# EAGLE design RedBot Accelerometer (EAGLE 9.6.0)
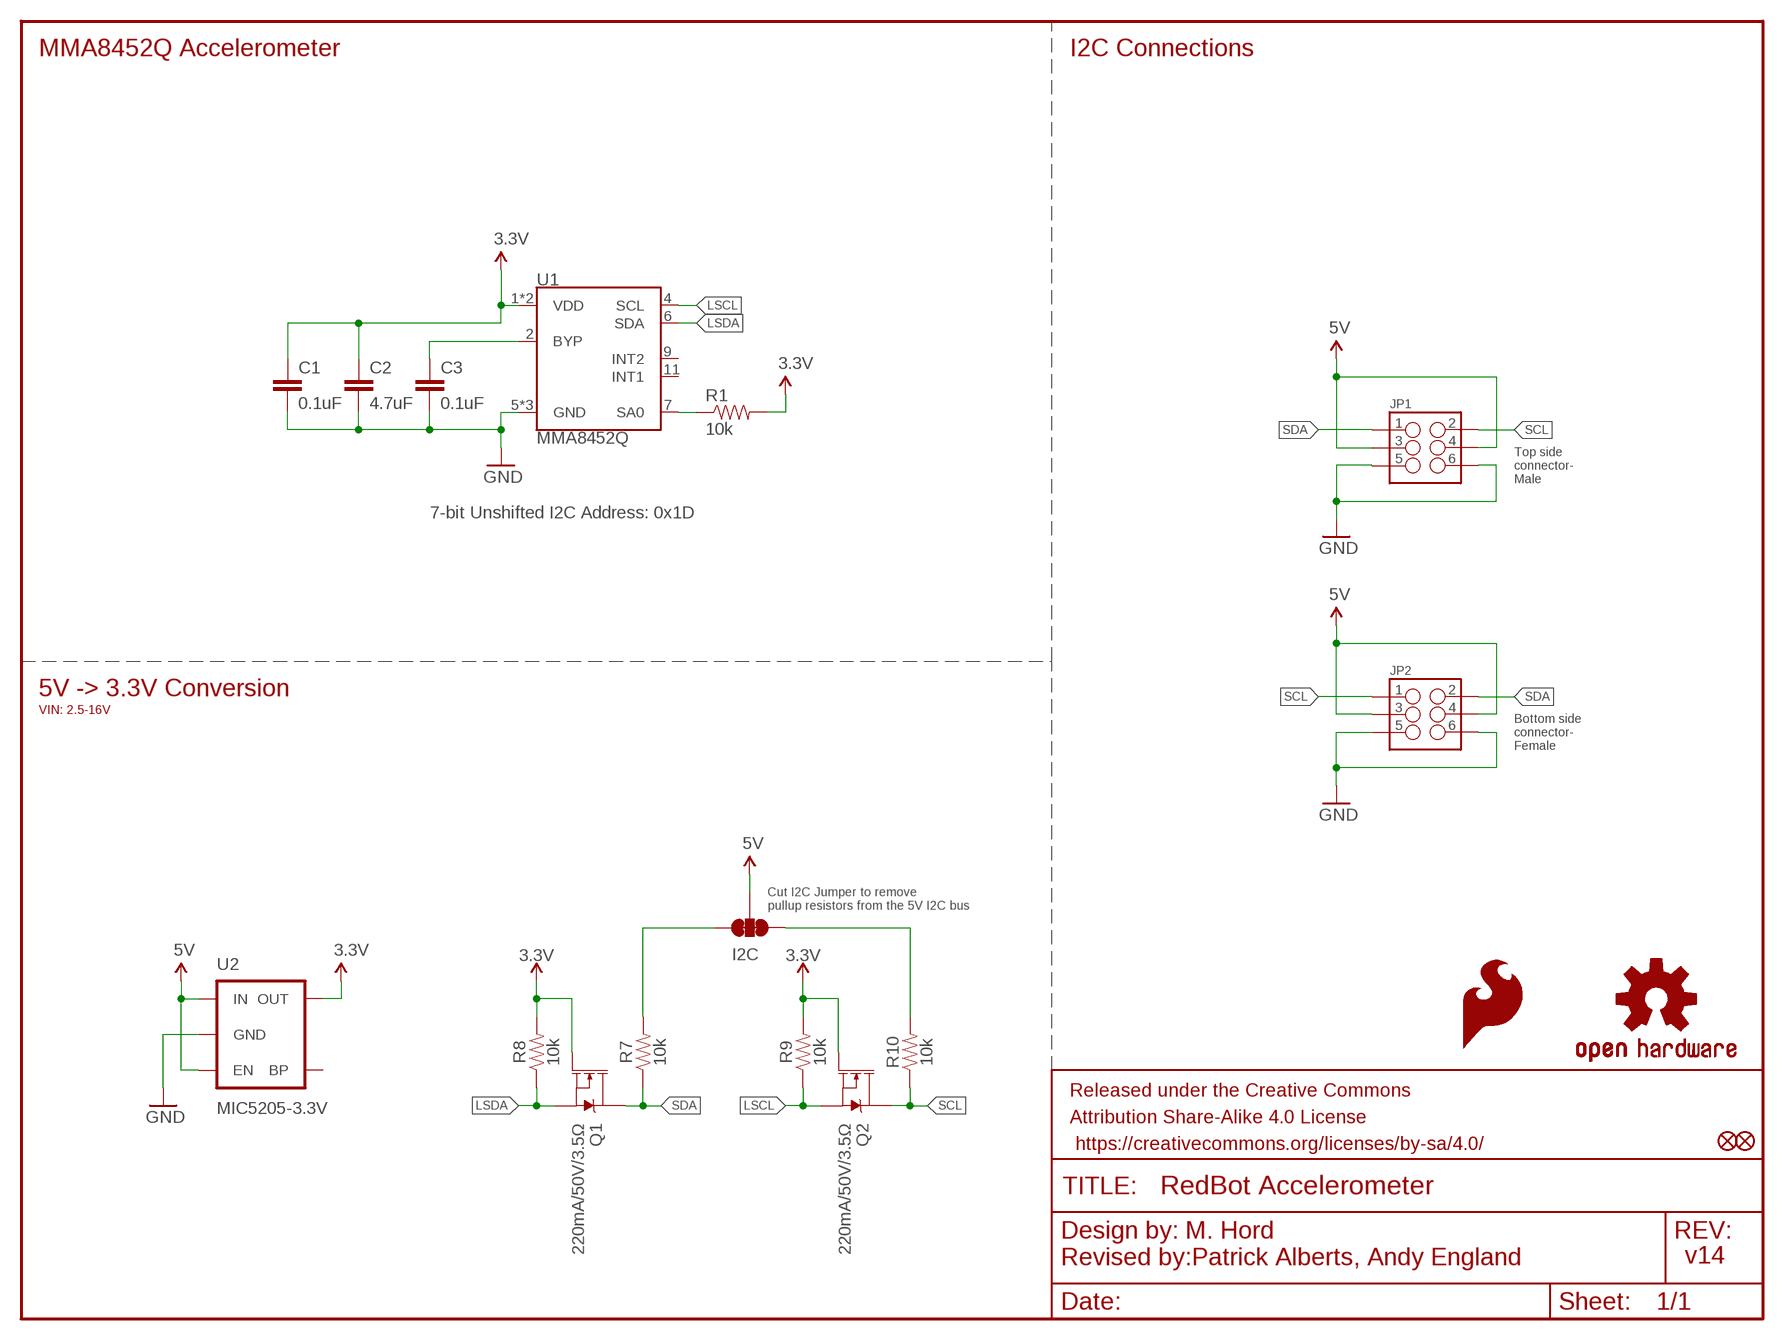
[diagram p0: schematic, sheet 1]

## Parts
C1  0.1uF  0.1UF-0603-25V-(+80/-20%)  [0603]
C2  4.7uF  4.7UF-0603-6.3V-(10%)  [0603]
C3  0.1uF  0.1UF-0603-25V-(+80/-20%)  [0603]
FID1  FIDUCIAL1X2  [FIDUCIAL-1X2]
FID3  FIDUCIAL1X2  [FIDUCIAL-1X2]
FRAME1  FRAME-LETTER  [CREATIVE_COMMONS]
I2C  JUMPER-SMT_3_2-NC_TRACE_SILK  [SMT-JUMPER_3_2-NC_TRACE_SILK]
JP1  M03X2SMT  [2X3_SMT_POSTS]
JP2  M03X2FEMALE_SMD  [2X3_SMD]
LOGO2  OSHW-LOGOS  [OSHW-LOGO-S]
LOGO4  SFE_LOGO_FLAME.1_INCH  [SFE_LOGO_FLAME_.1]
Q1  220mA/50V/3.5Ω  MOSFET-NCH-BSS138  [SOT23-3]
Q2  220mA/50V/3.5Ω  MOSFET-NCH-BSS138  [SOT23-3]
R1  10k  10KOHM-0603-1/10W-1%  [0603]
R7  10k  10KOHM-0603-1/10W-1%  [0603]
R8  10k  10KOHM-0603-1/10W-1%  [0603]
R9  10k  10KOHM-0603-1/10W-1%  [0603]
R10  10k  10KOHM-0603-1/10W-1%  [0603]
U1  MMA8452Q  [QFN-16]
U2  MIC5205-3.3V  MIC52053.3V  [SOT23-5]

## Nets
3.3V: C1.1 C2.1 Q1.1(G) Q2.1(G) R1.2 R8.2 R9.2 U1.1(VDD) U1.14(VDD) U2.5(OUT)
5V: I2C.2 JP1.3 JP1.4 JP2.3 JP2.4 U2.1(IN) U2.3(EN)
ADDR: R1.1 U1.7(SA0)
GND: C1.2 C2.2 C3.2 JP1.5 JP1.6 JP2.5 JP2.6 U1.5(GND) U1.10(GND) U1.12(GND) U2.2(GND)
LSCL: Q2.2(S) R9.1 U1.4(SCL)
LSDA: Q1.2(S) R8.1 U1.6(SDA)
N$1: C3.1 U1.2(BYP)
N$3: I2C.3 R7.2
N$4: I2C.1 R10.2
SCL: JP1.2 JP2.1 Q2.3(D) R10.1
SDA: JP1.1 JP2.2 Q1.3(D) R7.1
Unconnected: U1.9(INT2) U1.11(INT1) U2.4(BP)

## Notes on the sheet
- MMA8452Q Accelerometer | I2C Connections
- Top side
  connector-
  Male
- 7-bit Unshifted I2C Address: 0x1D
- 5V -> 3.3V Conversion
- VIN: 2.5-16V
- Bottom side
  connector-
  Female
- Cut I2C Jumper to remove 
  pullup resistors from the 5V I2C bus
- M. Hord
- Revised by:Patrick Alberts, Andy England | v14

## Library data of the parts
C1 C3 = SparkFun-Capacitors:0.1UF: 0.1µF ceramic capacitors A capacitor is a passive two-terminal electrical component used to store electrical energy temporarily in an electric field.; PROD_ID: CAP-00810
C2 = SparkFun-Capacitors:4.7UF: 4.7µF ceramic capacitors A capacitor is a passive two-terminal electrical component used to store electrical energy temporarily in an electric field.; PROD_ID: CAP-08280
FID1 FID3 = SparkFun-Aesthetics:FIDUCIAL: Fiducial Alignment Points Point-of-reference for pick-and-place machines and other optical instruments.
FRAME1 = SparkFun-Aesthetics:FRAME-LETTER: Schematic Frame - Letter Standard 8.5x11 US Letter frame
I2C = SparkFun-Jumpers:JUMPER-SMT_3_2-NC_TRACE: Normally closed trace jumper (2 of 2 connections) This jumper has a trace between all three pads so they are normally closed (NC). Use a razor knife to open the connection(s). For best results follow the IPC guidelines for cutting traces: Cutout at least 0.063 mm (0.005 in). Remove all loose material to clean up the cut area. Seal the cut with an approved epoxy. Reapply solder to reclose the connection(s).
JP1 = SparkFun-Connectors:M03X2: 2x3 .1" header. Shrouded, with keying- CONN-10681 SMT- CONN-11415 Pogo pins- HW-11044; PROD_ID: CONN-11415
JP2 = SparkFun-Connectors:M03X2: 2x3 .1" header. Shrouded, with keying- CONN-10681 SMT- CONN-11415 Pogo pins- HW-11044; PROD_ID: CONN-11290
LOGO2 = SparkFun-Aesthetics:OSHW-LOGO: Open-Source Hardware (OSHW) Logo This logo indicates the piece of hardware it is found on incorporates a OSHW license and/or adheres to the definition of open source hardware found here: http://freedomdefined.org/OSHW
LOGO4 = SparkFun-Aesthetics:SFE_LOGO_FLAME: SparkFun Flame Logo This is the SparkFun flame logo. The logo on the schematic will always be the same size; the package variant is the height of the flame. Default layer for the logo on the board is tSilk.
Q1 Q2 = SparkFun-DiscreteSemi:MOSFET-NCH: N-channel MOSFETs Voltage controlled devices that allow control of high current outputs. SparkFun Products: SparkFun OpenScale <https://www.sparkfun.com/products/13261> SparkFun Digital Sandbox <https://www.sparkfun.com/products/12651> SparkFun Monster Moto Shield <https://www.sparkfun.com/products/10182> SparkFun MOSFET Power Controller <https://www.sparkfun.com/products/11214>; PROD_ID: TRANS-00830
R1 R7-R10 = SparkFun-Resistors:10KOHM: 10kΩ resistor A resistor is a passive two-terminal electrical component that implements electrical resistance as a circuit element. Resistors act to reduce current flow, and, at the same time, act to lower voltage levels within circuits. - Wikipedia; PROD_ID: RES-00824
U1 = SparkFun-Sensors:MMA8452Q: NXP MMA8452Q 3-Axis Digital Accelerometer The MMA8452Q is a smart low-power, three-axis, capacitive MEMS accelerometer with 12 bits of resolution. This accelerometer is packed with embedded functions with flexible user programmable options, configurable to two interrupt pins. Supply Voltage: 1.6-3.6V Range: +/- 2g, 4g, 8g Interface: I2C, 12-bit and 8-bit ODR: 1.56 Hz - 800 Hz Package: QFN-16 Datasheet <http://cache.freescale.com/files/sensors/doc/data_sheet/MMA8452Q.pdf> SparkFun Products SparkFun Triple Axis Accelerometer Breakout - MMA8452Q <https://www.sparkfun.com/products/12756> (SEN-12756) SparkFun RedBot Sensor - Accelerometer <https://www.sparkfun.com/products/12589> (SEN-12589); PROD_ID: IC-10769
U2 = SparkFun-PowerIC:MIC5205: MIC5205 150mA vreg 3.3V - VREG-00822 5V - VREG-00823; PROD_ID: VREG-00822

## Board
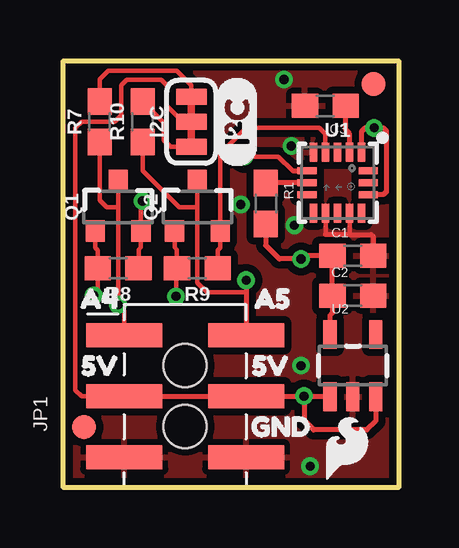
[diagram p1: board, top side]
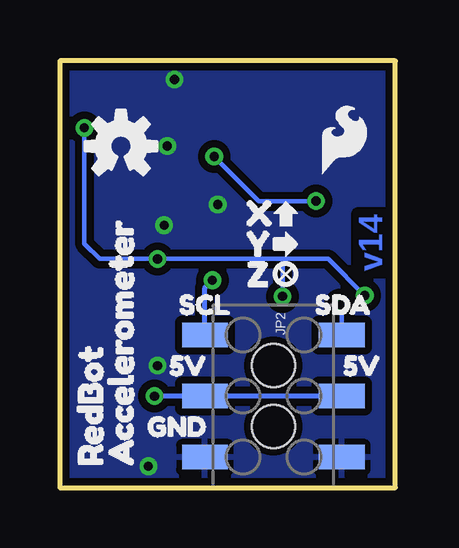
[diagram p2: board, bottom side, seen from below]

Size 13.97 x 17.78 mm. Coordinates in mm from the lower left corner, seen from the top.
Outline: 0,0 0,17.78 13.97,17.78 13.97,0 0,0
Copper layers (1*16): Top 0.035mm / dielectric 1.5mm / Bottom 0.035mm
Design rules "SparkFun-2-layer-TIGHT": minimum track width 7mil, minimum drill 15mil, track to track 7mil, track to pad 7mil, pad to pad 7mil, via to via 7mil, smd to smd 7mil, copper to edge 7mil, drill to drill 7mil, minimum pad ring 7mil, minimum via ring 7mil, stop-mask expansion 4mil, vias tented up to drill 25mil, thermal gap 10mil

### Footprints (pad centres in the part's own frame; a part is rotated, then mirrored left to right if it is on the bottom)
0603 = smd 1.1 x 1: 1 -0.85,0; 2 0.85,0
FIDUCIAL-1X2 = smd 1 x 1: 1 0,0
SMT-JUMPER_3_2-NC_TRACE_SILK = smd 0.66 x 1.27: 1 -1.041,0; 2 0,0; 3 1.041,0
2X3_SMT_POSTS = smd 1 x 3.17: 1 -2.54,-2.54; 2 -2.54,2.54; 3 0,-2.54; 4 0,2.54; 5 2.54,-2.54; 6 2.54,2.54 | hole 1.8: -1.27,0; 1.27,0
2X3_SMD = smd 1.02 x 1.9: 1 -2.54,-2.85; 2 -2.54,2.85; 3 0,-2.85; 4 0,2.85; 5 2.54,-2.85; 6 2.54,2.85
SOT23-3 = smd 0.8 x 0.9: 1 -0.95,-1; 2 0.95,-1; 3 0,1.1
QFN-16 = smd 0.8 x 0.3: 1 -1.275,1; 2 -1.275,0.5; 3 -1.275,0; 4 -1.275,-0.5; 5 -1.275,-1; 9 1.275,-1; 10 1.275,-0.5; 11 1.275,0; 12 1.275,0.5; 13 1.275,1 | smd 0.3 x 0.8: 6 -0.5,-1.275; 7 0,-1.275; 8 0.5,-1.275; 14 0.5,1.275; 15 0,1.275; 16 -0.5,1.275
SOT23-5 = smd 0.55 x 1.2: 1 -0.95,-1.3; 2 0,-1.3; 3 0.95,-1.3; 4 0.95,1.3; 5 -0.95,1.3

### Placement (x,y rotation side)
C1  12.06,9.65 0 top
C2  12.06,8 0 top
C3  10.92,15.9 180 top
FID1  12.93,16.81 0 top
FID3  0.86,2.51 0 top
FRAME1  -21.59,-7.62 0 top  (outside the outline)
I2C  5.33,15.24 90 top
JP1  5.08,3.81 270 top
JP2  5.08,3.81 270 bottom
LOGO2  11.43,14.22 0 bottom
LOGO3  LOGO-SFESK  [SFE-LOGO-FLAME]  3.05,13.08 0 bottom
LOGO4  11.81,1.65 0 top
Q1  2.29,11.68 0 top
Q2  5.59,11.68 0 top
R1  8.43,11.84 270 top
R7  1.52,15.24 90 top
R8  2.29,9.14 180 top
R9  5.59,9.14 180 top
R10  3.3,15.24 90 top
U1  11.43,12.7 270 top
U2  12.06,5.08 0 top
U$1  [X0]  7.11,11.43 0 bottom
U$2  [A42]  0,7.87 0 top
U$3  [A53]  7.24,7.87 0 top
U$4  [_5V1]  6.86,5.08 0 top
U$5  [_5V1]  -0.25,5.08 0 top
U$6  [GND0]  7.11,2.54 0 top
U$7  [GND0]  11.05,2.54 0 bottom
U$8  [_5V1]  10.41,5.08 0 bottom
U$9  [SDA6]  4.06,7.62 0 bottom
U$10  [_SCL7]  10.03,7.62 0 bottom
U$11  [_5V1]  3.17,5.08 0 bottom
U$12  [##3]  6.1,10.16 0 bottom
U$13  [##4]  6.1,11.43 0 bottom
U$14  [Y1]  7.11,10.16 0 bottom
U$15  [Z2]  7.11,8.89 0 bottom
U$16  [REDBOT4]  12.7,0 90 bottom
U$17  [ACCELEROMETER5]  11.43,0 90 bottom
U$19  [I2C]  7.24,13.34 90 top

### Tracks (layer width: path | path; a pad name or v marks a point on that pad's centre or on a via)
3.3V  (via drill 0.38)
  Top 0.178: Q2.1 4.64,10.02 4.74,9.92 R9.2 4.7,9.11 v4.7,7.96 | Q1.1 1.34,9.99 1.44,9.89 R8.2 1.44,8.17 v1.27,8
  Top 0.203: U2.5 11.12,7.18 11.21,7.28 C2.1 C1.1 10.03,9.65 v9.91,9.53 9,9.53 8.43,10.09 R1.2 | U1.14 13.34,12.2 13.46,12.32 13.46,14.86 13.34,14.99 v12.95,14.99 12.57,14.99 12.43,14.84 U1.1
  Bottom 0.178: v12.95,14.99 12.95,10.16 12.32,9.53 v9.91,9.53 4.72,9.53 | 4.72,9.53 2.79,9.53 v1.27,8 | v4.7,7.96 4.7,9.5 4.72,9.53
5V  (via drill 0.38)
  Top 0.178: JP1.3 0.76,3.81 0.51,4.06 0.51,14.99 0.77,15.25 2.15,15.25 2.41,15.52 2.41,16.76 2.64,16.99 4.09,16.99 4.32,16.76 4.32,15.9 4.98,15.24 I2C.2
  Top 0.203: v10.03,3.81 JP1.4 JP1.3 | v10.03,3.81 11.09,3.81 U2.1 | U2.3 13.02,2.76 12.65,2.4 10.43,2.4 10.03,2.79 v10.03,3.81
  Bottom 0.203: v10.03,3.81 JP2.3 JP2.4
ADDR
  Top 0.203: R1.1 8.45,12.7 U1.7
GND  (via drill 0.38)
  Top 0.178: U1.10 10.93,10.55 | U1.12 11.93,10.55
  Top 0.203: 10.93,10.55 11.93,10.55 11.94,10.54 12.83,10.54 12.91,10.45 C1.2
  other vias: 10.29,0.89 9.91,5.08 9.2,17 9.5,14.23 9.63,10.93 7.4,11.79
  pour Top (isolate 0.305): 0,17.78 13.97,17.78 13.97,0 0,0
  pour Bottom (isolate 0.305): 0,17.78 13.97,17.78 13.97,0 0,0
LSCL
  Top 0.178: R9.1 6.44,9.89 6.54,9.99 Q2.2 6.54,13.9 7.62,14.99 10.67,14.99 10.92,14.73 10.92,14.01
  Top 0.203: U1.4 10.92,13.98 10.92,14.01
LSDA  (via drill 0.38)
  Top 0.178: R8.1 3.14,9.92 3.24,10.02 Q1.2 3.24,11.87 v3.3,11.94 | v7.55,13.79 8.97,13.79 9.56,13.2
  Top 0.203: 9.56,13.2 U1.6
  Bottom 0.178: v7.55,13.79 5.69,11.94 v3.3,11.94
N$1
  Top 0.203: U1.2 11.93,14.74 11.77,14.9 C3.1
N$3
  Top 0.178: R7.2 1.52,17.02 1.88,17.37 4.72,17.37 5.33,16.76 I2C.3
N$4
  Top 0.178: R10.2 4.19,15.2 4.19,14.48 4.47,14.2 I2C.1
SCL  (via drill 0.38)
  Top 0.178: Q2.3 5.59,11.68 | 5.59,11.68 5.59,8.53 5.99,8.13 7.62,8.13 | 5.59,11.68 4.83,11.68 3.3,13.21 R10.1
  Top 0.203: v7.62,8.64 7.62,8.13 JP1.2
  Bottom 0.203: JP2.1 7.93,8.33 v7.62,8.64
SDA  (via drill 0.38)
  Top 0.178: R7.1 1.52,11.96 1.8,11.68 2.29,11.68 | JP1.1 2.54,7.37 v2.29,7.62 2.29,11.68 | Q1.3 2.29,11.68
  Bottom 0.178: JP2.2 2.23,7.56 v2.29,7.62

### Text on the board
Bottom: v14
tDocu: M. Hord | Revised by: Patrick Alberts, Andy England